# EAGLE schematic pcb (EAGLE 9.6.2)
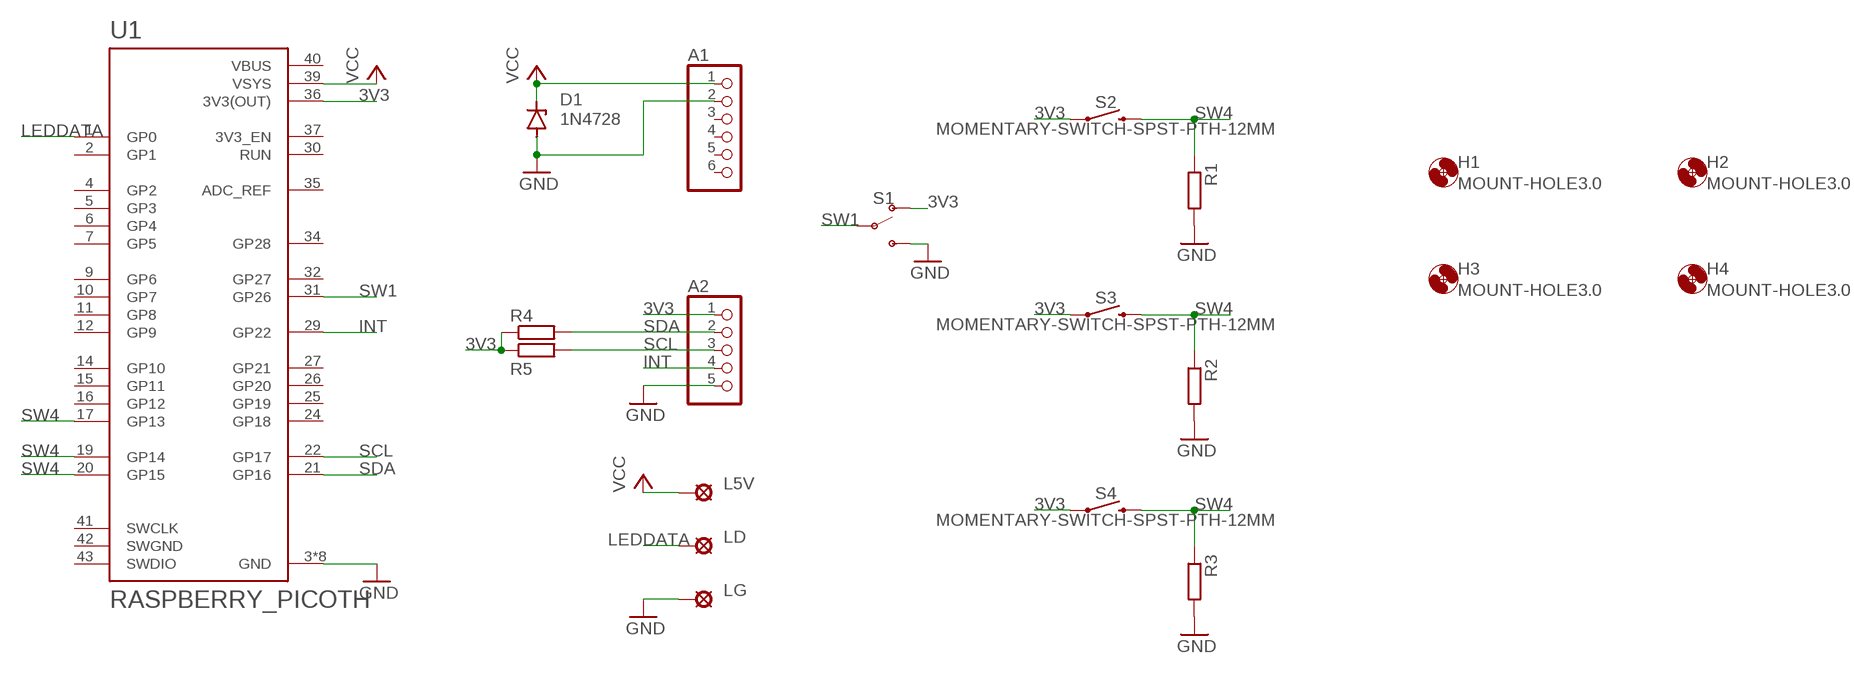
[diagram p0: schematic, sheet 1]

## Parts
A1  PINHD-1X6  [1X06]
A2  PINHD-1X5  [1X05]
D1  1N4728  [DO41Z10]
H1  MOUNT-HOLE3.0  [3,0]
H2  MOUNT-HOLE3.0  [3,0]
H3  MOUNT-HOLE3.0  [3,0]
H4  MOUNT-HOLE3.0  [3,0]
L5V  LSP10  [LSP10]
LD  LSP10  [LSP10]
LG  LSP10  [LSP10]
R1  R-EU_0207/7  [0207/7]
R2  R-EU_0207/7  [0207/7]
R3  R-EU_0207/7  [0207/7]
R4  R-EU_0207/7  [0207/7]
R5  R-EU_0207/7  [0207/7]
S1  SWITCH-SPDT-PTH-11.6X4.0MM-LOCK  [SWITCH_SPDT_PTH_11.6X4.0MM_LOCK]
S2  MOMENTARY-SWITCH-SPST-PTH-12MM  [TACTILE_SWITCH_PTH_12MM]
S3  MOMENTARY-SWITCH-SPST-PTH-12MM  [TACTILE_SWITCH_PTH_12MM]
S4  MOMENTARY-SWITCH-SPST-PTH-12MM  [TACTILE_SWITCH_PTH_12MM]
U1  RASPBERRY_PICOTH  [PICO-PKG-TH]

## Nets
3V3: A2.1 R4.1 R5.1 S1.1(O) S2.1 S3.1 S4.1 U1.36(3V3(OUT))
GND: A1.2 A2.5 D1.A LG.MP R1.2 R2.2 R3.2 S1.3(S) U1.3(GND) U1.8(GND) U1.13(GND) U1.18(GND) U1.23(GND) U1.28(GND) U1.33(GND) U1.38(GND)
INT: A2.4 U1.29(GP22)
LEDDATA: LD.MP U1.1(GP0)
SCL: A2.3 R5.2 U1.22(GP17)
SDA: A2.2 R4.2 U1.21(GP16)
SW1: S1.2(P) U1.31(GP26)
SW4: R1.1 R2.1 R3.1 S2.3 S3.3 S4.3 U1.17(GP13) U1.19(GP14) U1.20(GP15)
VCC: A1.1 D1.C L5V.MP U1.39(VSYS)
Unconnected: A1.3 A1.4 A1.5 A1.6 U1.2(GP1) U1.4(GP2) U1.5(GP3) U1.6(GP4) U1.7(GP5) U1.9(GP6) U1.10(GP7) U1.11(GP8) U1.12(GP9) U1.14(GP10) U1.15(GP11) U1.16(GP12) U1.24(GP18) U1.25(GP19) U1.26(GP20) U1.27(GP21) U1.30(RUN) U1.32(GP27) U1.34(GP28) U1.35(ADC_REF) U1.37(3V3_EN) U1.41(SWCLK) U1.43(SWDIO)

## Power pins joined to a net without a drawn wire
SWGND: U1.42(SWGND)
VBUS: U1.40(VBUS)

## Library data of the parts
A1 = pinhead:PINHD-1X6: PIN HEADER
A2 = pinhead:PINHD-1X5: PIN HEADER
D1 = diode:1N4728: Z DIODE 3.3 V, 1W, 5 percent
H1-H4 = holes:MOUNT-HOLE: MOUNTING HOLE with drill center marker
L5V LD LG = solpad:LSP10: SOLDER PAD drill 1.0 mm, distributor Buerklin, 12H555
R1-R5 = rcl:R-EU_: RESISTOR, European symbol; SPICEPREFIX: R
S1 = SparkFun-Switches:SWITCH-SPDT: Single Pole, Double Throw (SPDT) Switch Single-pole, double-throw (SPDT) switch. Variant Overview SMD-AYZ0202 Surface Mount DPDT Switch <https://www.sparkfun.com/products/597> (COM-00597) Used on e.g. LilyPad Arduino USB - ATmega32U4 Board <https://www.sparkfun.com/products/12049> PTH-11.6X4.0MM SPDT Mini Power Switch <https://www.sparkfun.com/products/102> (COM-00102) Used on e.g. SparkFun Simon Says - Through-Hole Soldering Kit <https://www.sparkfun.com/products/10547> (KIT-10547) PTH-11.6X4.0MM-KIT KIT version of SPDT Mini Power Switch - Simplifies soldering by removing tStop of switch pins - only one side can be soldered. PTH-11.6X4.0MM-LOCK LOCK version of SPDT Mini Power Switch - Offset pins hold switch in place for easier soldering. SMD-RIGHT-ANGLE Surface Mount Right Angle Switch <https://www.sparkfun.com/products/10860> (COM-10860) Used on e.g. SparkFun ESP8266 Thing <https://www.sparkfun.com/products/13231>; PROD_ID: SWCH-08261; SF_SKU: COM-00102
S2-S4 = SparkFun-Switches:MOMENTARY-SWITCH-SPST: Momentary Switch (Pushbutton) - SPST Normally-open (NO) SPST momentary switches (buttons, pushbuttons). Variants PTH-12MM - 12mm square, through-hole Momentary Pushbutton Switch - 12mm Square <https://www.sparkfun.com/products/9190> (COM-09190) PTH-6.0MM, PTH-6.0MM-KIT - 6.0mm square, through-hole Mini Pushbutton Switch <https://www.sparkfun.com/products/97> (COM-00097) KIT package intended for soldering kit's - only one side of pads' copper is exposed. PTH-RIGHT-ANGLE-KIT - Right-angle, through-hole Right Angle Tactile Button <https://www.sparkfun.com/products/10791> - Used on SparkFun BigTime Watch Kit <https://www.sparkfun.com/products/11734> SMD-12MM - 12mm square, surface-mount Tactile Button - SMD (12mm) <https://www.sparkfun.com/products/12993> (COM-12993) Used on SparkFun PicoBoard <https://www.sparkfun.com/products/11888> SMD-4.5MM - 4.5mm Square Trackball Switch Used on SparkFun Blackberry Trackballer Breakout <https://www.sparkfun.com/products/13169> SMD-4.6MMX2.8MM - 4.60mm x 2.80mm, surface mount Used on SparkFun SAMD21 Mini Breakout <https://www.sparkfun.com/products/13664> SMD-5.2MM, SMD-5.2-REDUNDANT - 5.2mm square, surface-mount Mini Pushbutton Switch - SMD <https://www.sparkfun.com/products/8720> (COM-08720) Used on Arduino Pro Mini <https://www.sparkfun.com/products/11114> REDUNDANT package connects both switch circuits together SMD-6.0X3.5MM - 6.0 x 3.5mm, surface mount Momentary Reset Switch SMD <https://www.sparkfun.com/products/8229> (COM-08229) SMD-6.2MM-TALL - 6.2mm square, surface mount Tactile Button - SMD (6mm) <https://www.sparkfun.com/products/12992> Used on SparkFun Digital Sandbox <https://www.sparkfun.com/products/12651> SMD-RIGHT-ANGLE - Right-angle, surface mount Used on SparkFun Block for Intel® Edison - Arduino <https://www.sparkfun.com/products/13036>; PROD_ID: SWCH-09185; SF_SKU: COM-09190
U1 = RpiPico:RASPBERRY_PICO: Raspberry Pi Pico